# Altium project DataTranslator.PrjPcb
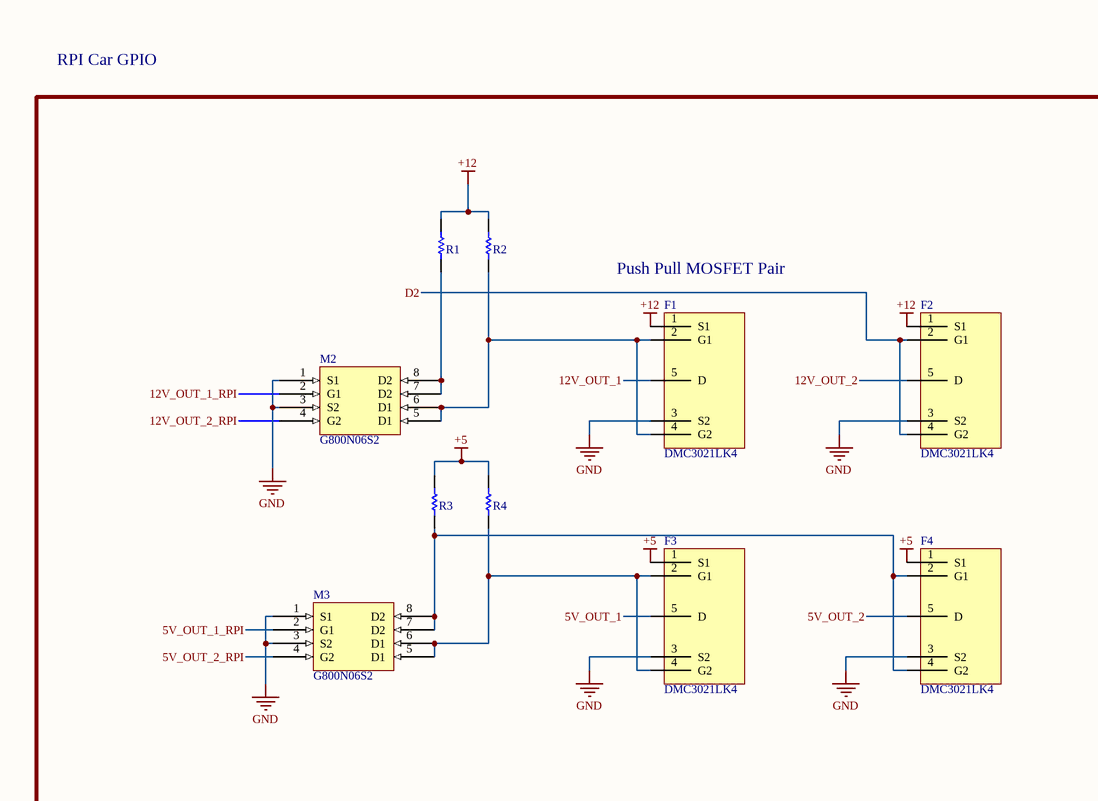
[diagram p0: DataTranslator.SchDoc, left]
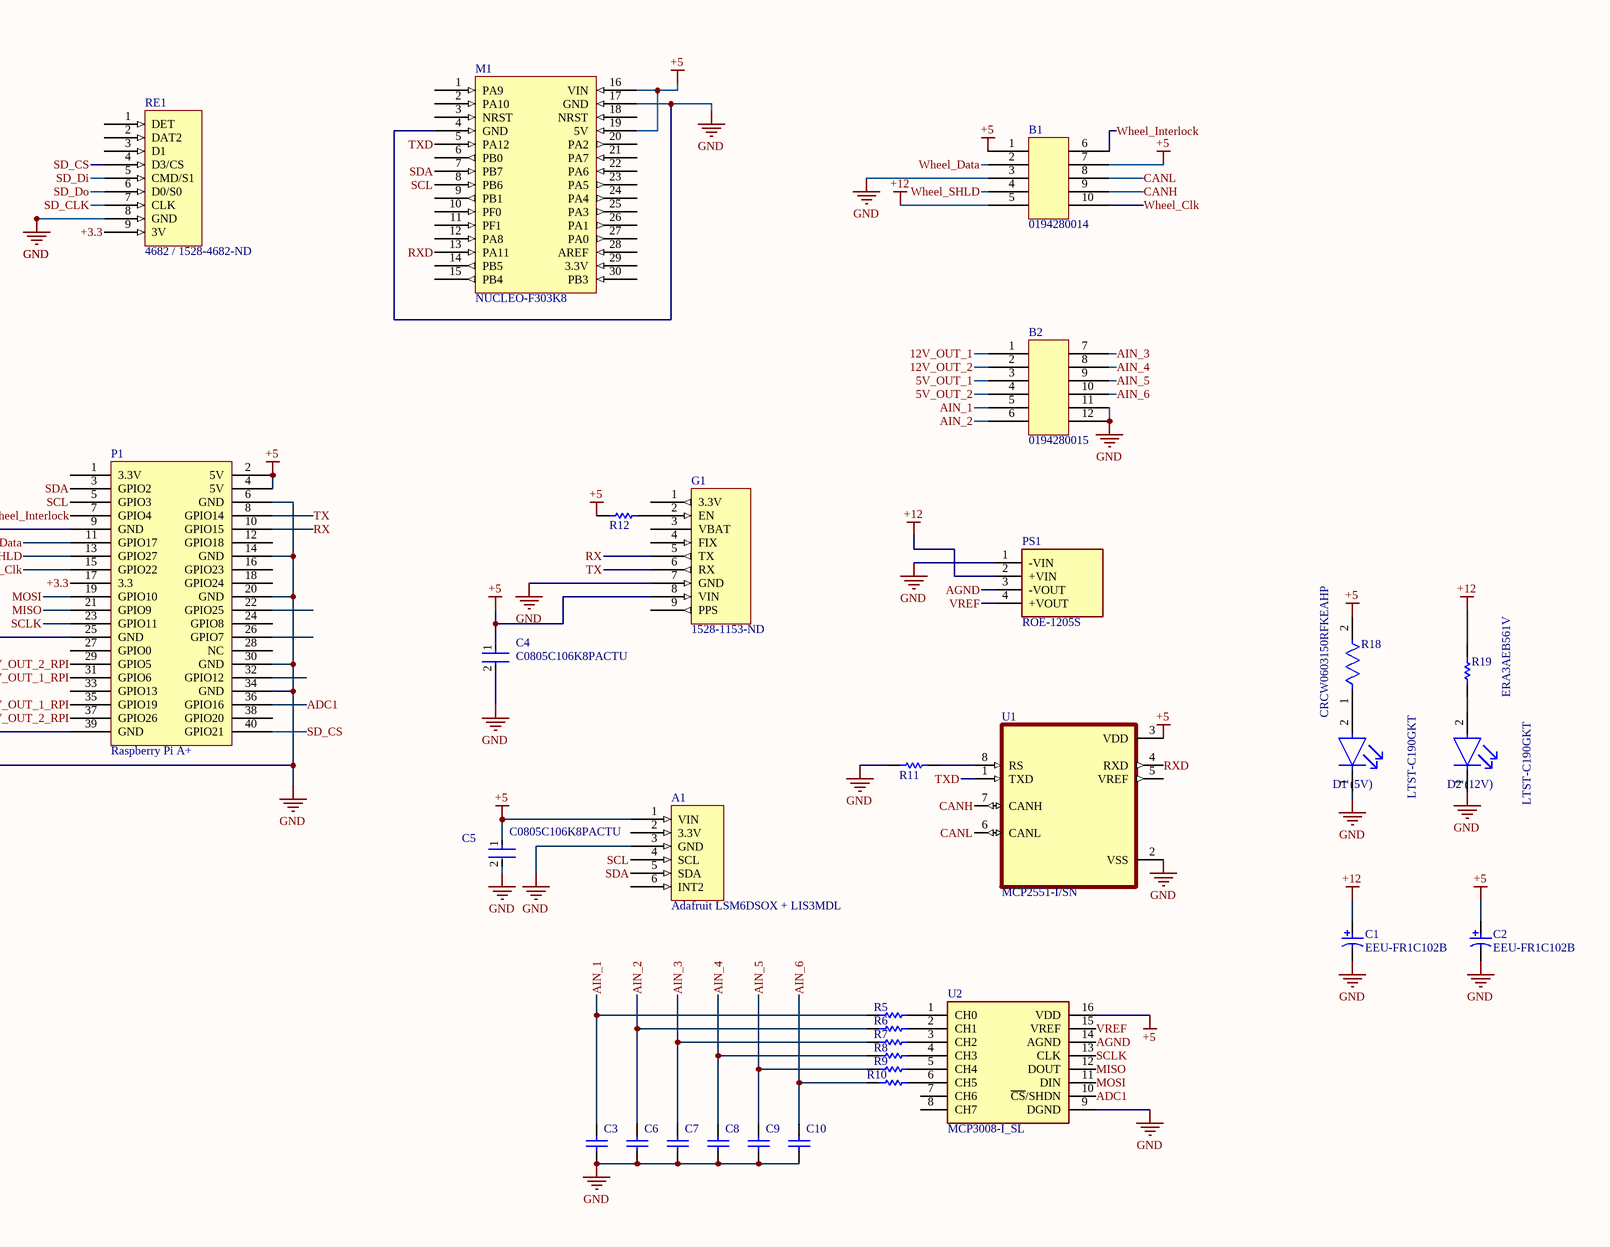
[diagram p1: DataTranslator.SchDoc, right]
1 sheet, 42 parts. Net scope: global (net labels, ports and power ports of the same name join across sheets).
Board file: DataTranslator.PcbDoc

## Sheet DataTranslator.SchDoc
size E; SheetNumber: 1; SheetTotal: 1

### Parts
A1  Adafruit LSM6DSOX + LIS3MDL  [4097 Accelerometer]
B1  0194280014  [0194280014]
B2  0194280015  [0194280015]
C1  EEU-FR1C102B  [PNSC-EEUFM1H221-2]
C2  EEU-FR1C102B  [PNSC-EEUFM1H221-2]
C3  C0805C105K4PACTU  [CAPC2013X145X50LL20T25]  (value not drawn)
C4  C0805C106K8PACTU  [FP-C0805C-DG-MFG]
C5  C0805C106K8PACTU  [FP-C0805C-DG-MFG]
C6  C0805C105K4PACTU  [CAPC2013X145X50LL20T25]  (value not drawn)
C7  C0805C105K4PACTU  [CAPC2013X145X50LL20T25]  (value not drawn)
C8  C0805C105K4PACTU  [CAPC2013X145X50LL20T25]  (value not drawn)
C9  C0805C105K4PACTU  [CAPC2013X145X50LL20T25]  (value not drawn)
C10  C0805C105K4PACTU  [CAPC2013X145X50LL20T25]  (value not drawn)
D1_(5V)  LTST-C190GKT  [FP-LTST-C190GKT-MFG]
D2_(12V)  LTST-C190GKT  [FP-LTST-C190GKT-MFG]
F1  DMC3021LK4  [DMC3021LK4]
F2  DMC3021LK4  [DMC3021LK4]
F3  DMC3021LK4  [DMC3021LK4]
F4  DMC3021LK4  [DMC3021LK4]
G1  1528-1153-ND  [GPS]
M1  NUCLEO-F303K8  [STM Footprint]
M2  G800N06S2  [G800N06S2]
M3  G800N06S2  [G800N06S2]
P1  Raspberry Pi A+  [Raspberry Pi A+]
PS1  ROE-1205S  [ROE-1205S]
R1  RC0805FR-0710KL  [RESC2013X60X35NL10T20]  (value not drawn)
R2  RC0805FR-0710KL  [RESC2013X60X35NL10T20]  (value not drawn)
R3  RC0805FR-0710KL  [RESC2013X60X35NL10T20]  (value not drawn)
R4  RC0805FR-0710KL  [RESC2013X60X35NL10T20]  (value not drawn)
R5  RC0805FR-0710KL  [RESC2013X60X35NL10T20]  (value not drawn)
R6  RC0805FR-0710KL  [RESC2013X60X35NL10T20]  (value not drawn)
R7  RC0805FR-0710KL  [RESC2013X60X35NL10T20]  (value not drawn)
R8  RC0805FR-0710KL  [RESC2013X60X35NL10T20]  (value not drawn)
R9  RC0805FR-0710KL  [RESC2013X60X35NL10T20]  (value not drawn)
R10  RC0805FR-0710KL  [RESC2013X60X35NL10T20]  (value not drawn)
R11  RC0805FR-0710KL  [RESC2013X60X35NL10T20]  (value not drawn)
R12  RC0805FR-0710KL  [RESC2013X60X35NL10T20]  (value not drawn)
R18  CRCW0603150RFKEAHP  [FP-CRCW0603-HPe3-MFG]
R19  ERA3AEB561V  [RESC1608X55X30LL20T20]
RE1  4682 / 1528-4682-ND  [SDCARD]
U1  MCP2551-I/SN  [CAN Transceiver]
U2  MCP3008-I_SL  [SOIC127P600X175-16N]

### Blocks framed on the sheet
Push Pull MOSFET Pair: F1-F4 M2 M3 R1-R4

### Nets
+5: A1.1(VIN) B1.1 B1.7 C2.1 C4.1 C5.1 F3.1(S1) F4.1(S1) G1.8(VIN) M1.16(VIN) M1.19(5V) P1.2(5V) P1.4(5V) R3.2 R4.2 R12.1 R18.2 U1.3(VDD) U2.16(VDD)
+12: B1.5 C1.1 F1.1(S1) F2.1(S1) PS1.2(+VIN) R1.2 R2.2 R19.2
GND: A1.3(GND) B1.3 B2.11 B2.12 C1.2 C2.2 C3.2 C4.2 C5.2 C6.2 C7.2 C8.2 C9.2 C10.2 D1_(5V).1(C) D2_(12V).1(C) F1.3(S2) F2.3(S2) F3.3(S2) F4.3(S2) G1.7(GND) M1.4(GND) M1.17(GND) M2.1(S1) M2.3(S2) M3.1(S1) M3.3(S2) P1.6(GND) P1.9(GND) P1.14(GND) P1.20(GND) P1.25(GND) P1.30(GND) P1.34(GND) P1.39(GND) PS1.1(-VIN) R11.1 RE1.8(GND) U1.2(VSS) U2.9(DGND)
5V_OUT_1: B2.3 F3.5(D)
5V_OUT_1_RPI: M3.2(G1) P1.35(GPIO19)
5V_OUT_2: B2.4 F4.5(D)
5V_OUT_2_RPI: M3.4(G2) P1.37(GPIO26)
12V_OUT_1: B2.1 F1.5(D)
12V_OUT_1_RPI: M2.2(G1) P1.31(GPIO6)
12V_OUT_2: B2.2 F2.5(D)
12V_OUT_2_RPI: M2.4(G2) P1.29(GPIO5)
+3.3: P1.17(3.3) RE1.9(3V)
ADC1: P1.36(GPIO16) U2.10(~{CS}/SHDN)
AGND: PS1.3(-VOUT) U2.14(AGND)
AIN_1: B2.5 C3.1 R5.1
AIN_2: B2.6 C6.1 R6.1
AIN_3: B2.7 C7.1 R7.1
AIN_4: B2.8 C8.1 R8.1
AIN_5: B2.9 C9.1 R9.1
AIN_6: B2.10 C10.1 R10.1
CANH: B1.9 U1.7(CANH)
CANL: B1.8 U1.6(CANL)
D2: F2.2(G1) F2.4(G2)
MISO: P1.21(GPIO9) U2.12(DOUT)
MOSI: P1.19(GPIO10) U2.11(DIN)
RX: G1.5(TX) P1.10(GPIO15)
RXD: M1.13(PA11) U1.4(RXD)
SCL: A1.4(SCL) M1.8(PB6) P1.5(GPIO3)
SCLK: P1.23(GPIO11) U2.13(CLK)
SD_CLK: RE1.7(CLK)
SD_CS: P1.40(GPIO21) RE1.4(D3/CS)
SD_Di: RE1.5(CMD/S1)
SD_Do: RE1.6(D0/S0)
SDA: A1.5(SDA) M1.7(PB7) P1.3(GPIO2)
TX: G1.6(RX) P1.8(GPIO14)
TXD: M1.5(PA12) U1.1(TXD)
VREF: PS1.4(+VOUT) U2.15(VREF)
Wheel_Clk: B1.10 P1.15(GPIO22)
Wheel_Data: B1.2 P1.11(GPIO17)
Wheel_Interlock: B1.6 P1.7(GPIO4)
Wheel_SHLD: B1.4 P1.13(GPIO27)
NetD1_(5V)_2: D1_(5V).2(A) R18.1
NetD2_(12V)_2: D2_(12V).2(A) R19.1
NetF1_2: F1.2(G1) F1.4(G2) M2.5(D1) M2.6(D1) R2.1
NetF3_2: F3.2(G1) F3.4(G2) M3.5(D1) M3.6(D1) R4.1
NetF4_2: F4.2(G1) F4.4(G2) M3.7(D2) M3.8(D2) R3.1
NetG1_2: G1.2(EN) R12.2
NetM2_7: M2.7(D2) M2.8(D2) R1.1
NetR5_2: R5.2 U2.1(CH0)
NetR6_2: R6.2 U2.2(CH1)
NetR7_2: R7.2 U2.3(CH2)
NetR8_2: R8.2 U2.4(CH3)
NetR9_2: R9.2 U2.5(CH4)
NetR10_2: R10.2 U2.6(CH5)
NetR11_2: R11.2 U1.8(RS)

Not connected (* = marked no-connect by the designer): A1 2(3.3V) 6(INT2); G1 1(3.3V) 3(VBAT) 4(FIX) 9(PPS); M1 1(PA9) 2(PA10) 3(NRST) 6(PB0) 9(PB1) 10(PF0) 11(PF1) 12(PA8) 14(PB5) 15(PB4) 18(NRST) 20(PA2) 21(PA7) 22(PA6) 23(PA5) 24(PA4) 25(PA3) 26(PA1) 27(PA0) 28(AREF) 29(3.3V) 30(PB3); P1 1(3.3V) 12(GPIO18) 16(GPIO23) 18(GPIO24) 22(GPIO25) 24(GPIO8) 26(GPIO7) 27(GPIO0) 28(NC) 32(GPIO12) 33(GPIO13) 38(GPIO20); RE1 1(DET) 2(DAT2) 3(D1); U1 5(VREF); U2 7(CH6) 8(CH7)

### Notes on the sheet
- RPI Car GPIO

### Library data of the parts
A1 = 4097: ADXL343 - TRIPLE-AXIS ACCELEROMETER; Manufacturer: Adafruit Industries; Supplier: Mouser; Supplier Part Number: 485-4097; Manufacturer Part Number: 4097; RoHS: No; Stock: 330; Pricing: 1=5.95, 10=5.95, 50=5.95, 100=5.95, 1000=5.95, 10000=5.95 (USD)
B1 = 0194280014: Combination Line Connector, 10 Contact(s), Male, Solder Terminal; Manufacturer: Molex; Manufacturer Series: 19428; Contact Pattern: RECTANGULAR; Number Of Connectors: 1; Number Of PCB Rows: 2; Number of Contacts: 10; Mating Contact Pitch: 0.23inch; Mounting Option 1: LOCKING; PCB Contact Row Spacing: 5.9944mm; Plating Thickness: 100uin; Reference Standard: UL; Reliability: COMMERCIAL; Supplier: Mouser; Supplier Part Number: 538-19428-0014; Manufacturer Part Number: 0194280014; RoHS: Yes; Category: Uncategorized; Stock: 2675; Pricing: 1=6.21, 10=5.7, 50=5.7, 100=4.98, 1000=4.6, 10000=4.6 (USD); Mounting Technology: Board; Contact Finish - Mating: NOT SPECIFIED; Contact Finish - Termination: TIN OVER NICKEL; Insulation Color: Black; Insulation Material: Polybutylene; Connector Type: COMBINATION LINE CONNECTOR; Contact Gender: Male; Mounting Style: STRAIGHT; Number of Rows Loaded: 2; PCB Contact Pattern: RECTANGULAR; Termination: Solder; Terminal Pitch: 5.842mm; Reach SVHC Compliant: Yes; RoHS Compliant: Yes; ComponentLink1URL: https://datasheet.ciiva.com:443/pdfs/VipMasterIC/IC/MOLE/MOLE-S-A0006767587/MOLE-S-A0006776083-1.pdf?src-supplier=IHS+Markit; ComponentLink1Description: https://datasheet.ciiva.com:443/pdfs/VipMasterIC/IC/MOLE/MOLE-S-A0006767587/MOLE-S-A0006776083-1.pdf?src-supplier=IHS+Markit; ComponentLink2URL: https://datasheet.ciiva.com/41799/194280014-sd-41799129.pdf?src-supplier=Digi-Key; ComponentLink2Description: https://datasheet.ciiva.com/41799/194280014-sd-41799129.pdf?src-supplier=Digi-Key; ComponentLink3URL: https://datasheet.ciiva.com/10081/0194280014-pcb-headers-10081631.pdf?src-supplier=Avnet; ComponentLink3Description: https://datasheet.ciiva.com/10081/0194280014-pcb-headers-10081631.pdf?src-supplier=Avnet
B2 = 0194280015: Combination Line Connector; Manufacturer: Molex; Manufacturer Part Number: 0194280014; Manufacturer Series: 19428; Contact Pattern: RECTANGULAR; Number Of Connectors: 1; Number Of PCB Rows: 2; Number of Contacts: 10; Mating Contact Pitch: 0.23inch; Mounting Option 1: LOCKING; PCB Contact Row Spacing: 5.9944mm; Plating Thickness: 100uin; Reference Standard: UL; Reliability: COMMERCIAL; Supplier: Mouser; Supplier Part Number: 538-19428-0014; RoHS: Yes; Category: Uncategorized; Stock: 2675; Pricing: 1=6.21, 10=5.7, 50=5.7, 100=4.98, 1000=4.6, 10000=4.6 (USD); Mounting Technology: Board; Contact Finish - Mating: NOT SPECIFIED; Contact Finish - Termination: TIN OVER NICKEL; Insulation Color: Black; Insulation Material: Polybutylene; Connector Type: COMBINATION LINE CONNECTOR; Contact Gender: Male; Mounting Style: STRAIGHT; Number of Rows Loaded: 2; PCB Contact Pattern: RECTANGULAR; Termination: Solder; Terminal Pitch: 5.842mm; Reach SVHC Compliant: Yes; RoHS Compliant: Yes; ComponentLink1URL: https://datasheet.ciiva.com:443/pdfs/VipMasterIC/IC/MOLE/MOLE-S-A0006767587/MOLE-S-A0006776083-1.pdf?src-supplier=IHS+Markit; ComponentLink1Description: https://datasheet.ciiva.com:443/pdfs/VipMasterIC/IC/MOLE/MOLE-S-A0006767587/MOLE-S-A0006776083-1.pdf?src-supplier=IHS+Markit; ComponentLink2URL: https://datasheet.ciiva.com/41799/194280014-sd-41799129.pdf?src-supplier=Digi-Key; ComponentLink2Description: https://datasheet.ciiva.com/41799/194280014-sd-41799129.pdf?src-supplier=Digi-Key; ComponentLink3URL: https://datasheet.ciiva.com/10081/0194280014-pcb-headers-10081631.pdf?src-supplier=Avnet; ComponentLink3Description: https://datasheet.ciiva.com/10081/0194280014-pcb-headers-10081631.pdf?src-supplier=Avnet; ComponentLink4URL: https://datasheet.ciiva.com:443/pdfs/VipMasterIC/IC/MOLE/MOLES064408/MOLES064297-1.pdf?src-supplier=IHS+Markit; ComponentLink4Description: https://datasheet.ciiva.com:443/pdfs/VipMasterIC/IC/MOLE/MOLES064408/MOLES064297-1.pdf?src-supplier=IHS+Markit; ComponentLink5URL: https://datasheet.ciiva.com/6846/194280031-sd-6846247.pdf?src-supplier=Digi-Key; ComponentLink5Description: https://datasheet.ciiva.com/6846/194280031-sd-6846247.pdf?src-supplier=Digi-Key; ComponentLink6URL: https://datasheet.ciiva.com/9467/0194280015-pcb-headers-9467422.pdf?src-supplier=Avnet; ComponentLink6Description: https://datasheet.ciiva.com/9467/0194280015-pcb-headers-9467422.pdf?src-supplier=Avnet
C1 C2 = CMP-2000-05313-1: Aluminum Electrolytic Capacitor, 1000 uF, +/- 20%, 16 V, -40 to 105 degC, 2-Pin THD, RoHS, Tape and Reel; Manufacturer: Panasonic; Capacitance: 1000µF; Ripple Current: 1790mA; Rated Voltage: 16V; Impedance: 0.028O; Type: Radial; Lifetime@Temperature: 8000Hrs@105degC; Operating Temp-Max: 105degC; Operating Temp Range: -40to+105degC; Manufacturer URL: http://www.panasonic.com/; Datasheet URL: http://www.produktinfo.conrad.com/datenblaetter/425000-449999/446746-da-01-en-ALU_KONDENSATOR_FR_R_1000_UF_16V.pdf; Case Size/Dimension: Ø10x16mm; Datasheet Version: Nov-11; Series: FR
C3 C6-C10 = CMP-1036-04746-2: Manufacturer: Kemet; Part Number: C0805C105K4PACTU
C4 C5 = CMP-2007-03243-2: CAP CER 10UF 10V X5R 0805; Manufacturer: Kemet; 3DS Part Number: 220-00001; Tolerance: 10%; Temperature Coefficient: 15%; Material: Ceramic; Device Class L2: Capacitors; Device Class L1: Passive Components; ComponentLink2URL: https://content.kemet.com/datasheets/KEM_C1006_X5R_SMD.pdf; Height: 1.4mm; Lead Free: Yes; Manufacturer Part Number: C0805C106K8PACTU; Digikey Description: CAP CER 10UF 10V X5R 0805; Octopart: https://octopart.com/c0805c106k8pactu-kemet-98697; Capacitance: 10uF; Value: 10uF; Temperature Range Low: -55°C; Temperature: -55°C to +85°C; Automotive: No; Mouser Description: CAP CER 10UF 10V X5R 0805; Ipc Land Pattern Name: CAPC200125X125; Temperature Range High: +85°C; Voltage: 10V; RoHS: TRUE; Device Class L3: Ceramic Capacitors; ComponentLink2Description: Datasheet; Voltage Rating: 10V; Package: C0805C-DG; Temperature Characteristic: X5R; Category: Cap
D1_(5V) D2_(12V) = CMP-22017-000005-2: LED GREEN CLEAR CHIP SMD; Dominant Wavelength: 569nm; Reverse Voltage: 5V; Lens Color: Colorless; Viewing Angle: 130°; Voltage: 2V; Forward Current: 30mA; Power Dissipation: 100mW; Luminous Intensity: 6mcd; Number of LEDs: 1; Forward Voltage: 2.1V; Wavelength: 565nm; Test Current: 10mA; Min Operating Temperature: -55°C; Lens Style: Clear; Mount: Surface Mount; Width: 0.8mm; Packaging: Tape and Reel; Lens Transparency: Clear; Case Code (Metric): 1608; Depth: 0.8mm; Case Code (Imperial): 0603; Case/Package: 0603; Number of Pins: 2; Max Operating Temperature: 85°C; Lead Free: Lead Free; Number of Elements: 1; Length: 1.6mm; Height: 0.8mm; Package Quantity: 1; Power Rating: 100mW; Radiation Hardening: No; Illumination Color: Green; Color: Green
F1-F4 = DMC3021LK4: Power Field-Effect Transistor, 6.7A I(D), 30V, 0.021ohm, 2-Element, N-Channel and P-Channel, Silicon, Metal-oxide Semiconductor FET; Manufacturer: Diodes; Manufacturer Part Number: DMC3021LK4-13; Package Body Material: Plastic; Polarity/Channel Type: N-CHANNEL,P-CHANNEL; Additional Feature: HIGH RELIABILITY; Drain Current-Max (Abs) (ID): 14A; Drain-source On Resistance-Max: 21mR; Number of Elements: 2; Operating Mode: ENHANCEMENT MODE; Power Dissipation-Max (Abs): 22W; Pulsed Drain Current-Max (IDM): 40A; Time @ Peak Reflow Temperature-Max (s): 40s; Transistor Application: SWITCHING; Supplier: Digi-Key; Supplier Part Number: DMC3021LK4-13DICT-ND; RoHS: Yes; Category: MOSFETs; Stock: 2345; Pricing: 1=0.63, 10=0.536, 100=0.4004, 500=0.31462, 1000=0.24312 (USD); Pins: 4; Transistor Element Material: SILICON; Package Shape: Rectangular; Terminal Finish: Tin; Max Operating Temperature: 150°C; JESD-609 Code: e3; Drain Current-Max (ID): 6.7A; DS Breakdown Voltage-Min: 30V; FET Technology: METAL-OXIDE SEMICONDUCTOR; Moisture Sensitivity Level: 1; Package Style: SMALL OUTLINEMeter; Peak Reflow Temperature (Cel): 260°C; Surface Mount: Yes; Terminal Form: Gull Wing; Terminal Position: SINGLE; Reach SVHC Compliant: Yes; RoHS Compliant: Yes; ComponentLink1URL: https://datasheet.ciiva.com:443/pdfs/VipMasterIC/IC/DIOD/DIODS21602/DIODS21602-1.pdf?src-supplier=IHS+Markit; ComponentLink1Description: https://datasheet.ciiva.com:443/pdfs/VipMasterIC/IC/DIOD/DIODS21602/DIODS21602-1.pdf?src-supplier=IHS+Markit; ComponentLink2URL: https://datasheet.ciiva.com/6386/dmc3021lk4-6386737.pdf?src-supplier=Digi-Key; ComponentLink2Description: https://datasheet.ciiva.com/6386/dmc3021lk4-6386737.pdf?src-supplier=Digi-Key; ComponentLink3URL: https://datasheet.ciiva.com/4443/dmc3021lk4-80786-4443001.pdf?src-supplier=Mouser; ComponentLink3Description: https://datasheet.ciiva.com/4443/dmc3021lk4-80786-4443001.pdf?src-supplier=Mouser; ComponentLink4URL: https://datasheet.ciiva.com/930/dmc3021lk4-930444.pdf?src-supplier=Digi-Key; ComponentLink4Description: https://datasheet.ciiva.com/930/dmc3021lk4-930444.pdf?src-supplier=Digi-Key; ComponentLink5URL: https://datasheet.ciiva.com/6386/dmc3021lk4-6386734.pdf?src-supplier=Digi-Key; ComponentLink5Description: https://datasheet.ciiva.com/6386/dmc3021lk4-6386734.pdf?src-supplier=Digi-Key; ComponentLink6URL: https://datasheet.ciiva.com/11174/dmc3021lk4-11174949.pdf?src-supplier=Avnet; ComponentLink6Description: https://datasheet.ciiva.com/11174/dmc3021lk4-11174949.pdf?src-supplier=Avnet
G1 = 1528-1153-ND: GPS BREAKOUT 66CH W/10HZ UPDATES; Manufacturer: Adafruit Industries; Manufacturer Part Number: 746; Supplier: Digi-Key; Supplier Part Number: 1528-1153-ND; RoHS: Yes; Category: RF Semiconductors and Devices; Stock: 65; Pricing: 1=29.95 (USD); ComponentLink1URL: https://media.digikey.com/pdf/Data%20Sheets/Adafruit%20PDFs/746_Web.pdf?src-supplier=Digi-Key; ComponentLink1Description: https://media.digikey.com/pdf/Data%20Sheets/Adafruit%20PDFs/746_Web.pdf?src-supplier=Digi-Key; ComponentLink2URL: http://www.alliedelec.com/m/d/a201c4d28f3644f3ee4dce0b4167d661.pdf?src-supplier=Allied+Electronics; ComponentLink2Description: http://www.alliedelec.com/m/d/a201c4d28f3644f3ee4dce0b4167d661.pdf?src-supplier=Allied+Electronics
M1 = NUCLEO-F303K8: Boards/Accessories; Manufacturer: STMicroelectronics; Evaluation Kit: Yes; Number of Bits: 32; Core Architecture: ARM; Supplier: Newark; Supplier Part Number: 68Y1244; Manufacturer Part Number: NUCLEO-F303K8; RoHS: No; Category: Embedded Processors and Controllers; Stock: 226; Pricing: 1=10.33000 (USD); Series: STM32F3; Reach SVHC Compliant: Yes; Lead Free: Lead Free; ComponentLink1URL: http://www.farnell.com/datasheets/2064195.pdf?src-supplier=Farnell; ComponentLink1Description: http://www.farnell.com/datasheets/2064195.pdf?src-supplier=Farnell; ComponentLink2URL: http://www.st.com/content/ccc/resource/technical/document/data_brief/b1/d8/13/d4/b0/b7/4b/6e/DM00214578.pdf/files/DM00214578.pdf/jcr:content/translations/en.DM00214578.pdf?src-supplier=Digi-Key; ComponentLink2Description: http://www.st.com/content/ccc/resource/technical/document/data_brief/b1/d8/13/d4/b0/b7/4b/6e/DM00214578.pdf/files/DM00214578.pdf/jcr:content/translations/en.DM00214578.pdf?src-supplier=Digi-Key; ComponentLink3URL: http://www.st.com/st-web-ui/static/active/en/resource/technical/document/user_manual/DM00116575.pdf?s_searchtype=keyword&src-supplier=Avnet; ComponentLink3Description: http://www.st.com/st-web-ui/static/active/en/resource/technical/document/user_manual/DM00116575.pdf?s_searchtype=keyword&src-supplier=Avnet; ComponentLink4URL: http://www.farnell.com/datasheets/1966773.pdf?src-supplier=Element14; ComponentLink4Description: http://www.farnell.com/datasheets/1966773.pdf?src-supplier=Element14; ComponentLink5URL: http://www.farnell.com/datasheets/2064195.pdf?src-supplier=Newark; ComponentLink5Description: http://www.farnell.com/datasheets/2064195.pdf?src-supplier=Newark
M2 M3 = G800N06S2: DUAL N-Channel Enhancement Mode Power MOSFET; Manufacturer: GoFord; Supplier: Digi-Key; Supplier Part Number: 3141-G800N06S2CT-ND; Manufacturer Part Number: G800N06S2; RoHS: No; Stock: 3988; Pricing: 1=0.49, 10=0.395, 100=0.2688, 500=0.2016, 1000=0.1512, 2000=0.1386 (USD)
P1 = Raspberry Pi A+: SINGLE BOARD COMPUTER 700MHZ 256; Supplier: Digi-Key; Supplier Part Number: 2648-RASPBERRYPIA+-ND; Manufacturer: Raspberry Pi; Manufacturer Part Number: RASPBERRY PI A+; RoHS: Yes; Category: Single Board Computers (SBCs); Pricing: 1=20 (USD); ComponentLink1URL: https://media.digikey.com/pdf/Data%20Sheets/Raspberry%20Pi%20PDFs/Raspberry_PI_1_Model_A+_Web.pdf?src-supplier=Digi-Key; ComponentLink1Description: https://media.digikey.com/pdf/Data%20Sheets/Raspberry%20Pi%20PDFs/Raspberry_PI_1_Model_A+_Web.pdf?src-supplier=Digi-Key
PS1 = ROE-1205S: Recom Through Hole 1W Isolated DC-DC Converter, I/O isolation 1kV dc, Vout 5V dc; Manufacturer_Name: RECOM Power; Geometry.Height: 10.5mm; Manufacturer_Part_Number: ROE-1205S; Mouser Part Number: 919-ROE-1205S; Mouser Price/Stock: https://www.mouser.co.uk/ProductDetail/RECOM-Power/ROE-1205S?qs=wlO1EFRhkBDfK04Zv7WG%2Fg%3D%3D; Arrow Part Number: ROE-1205S; Arrow Price/Stock: https://www.arrow.com/en/products/roe-1205s/recom-power?region=nac; Datasheet Link: https://www.recom-power.com/pdf/Econoline/ROE.pdf
R1-R12 = CMP-1659-00013-4: Chip Resistor, 10 KOhm, +/- 1%, 0.125 W, -55 to 155 degC, 0805 (2012 Metric), RoHS, Tape and Reel; Manufacturer: Yageo; Voltage Rating: 150 V; Mount: Surface Mount; ComponentLink1Description: Manufacturer URL; ComponentLink2URL: http://www.yageo.com/documents/recent/PYu-RC_Group_51_RoHS_L_04.pdf; Pins: 2; Length: 2 mm; Min Operating Temperature: -55 degC; Height: 0.5 mm; Mounting Technology: Surface Mount; RoHSCompliant: true; REACH SVHC: No SVHC; ComponentLink1URL: http://www.yageo.com/; Max Operating Temperature: 155 degC; PackageReference: 0805; DatasheetVersion: Rev. 4, 02/2016; Package Quantity: 5000; Packaging: Tape and Reel; ComponentLink2Description: Datasheet; PackageDescription: 2-Pin Surface Mounted Device, Body 2 x 1.25 mm
R18 = CMP-02407-010710-1: RES Thick Film, 150Ω, 1%, 0.33W, 100ppm/°C, 0603; Voltage Rating: 75V; Power Rating: 250mW; Resistance: 150R; Case Code (Metric): 1608; Voltage Rating (DC): 75V; Packaging: Tape and Reel; Composition: Thick Film; Width: 0.033inch; Tolerance: 1%; Military Standard: Not; Max Operating Temperature: 155°C; Contact Plating: Tin; Case/Package: 0603; Features: Automotive AEC-Q200; Depth: 0.85mm; Height: 0.45mm; Package Quantity: 1; Case Code (Imperial): 0603; Temperature Coefficient: 100ppm/°C; Max Power Dissipation: 250mW; Lead Free: Lead Free; Min Operating Temperature: -55°C; Radiation Hardening: No; Mount: Surface Mount; Weight: 7.1E-05oz; Termination: SMD/SMT; Number of Terminations: 2; Length: 1.55mm
R19 = CMP-2000-00091-1: Manufacturer: Panasonic; Part Number: ERA3AEB561V
RE1 = 4682: MICROSD SPI/SPIO BREAKOUT BOARD; Manufacturer: Adafruit Industries; Supplier: Arrow Electronics; Supplier Part Number: 4682; Manufacturer Part Number: 4682; RoHS: No; Stock: 408; Pricing: 1=3.556 (USD)
U1 = MCP2551-I/SN: CAN Transceiver, 1-Trnsvr, PDSO8; Manufacturer: Microchip; Number of Terminals/Pins: 8; Package Body Material: Plastic; Max Supply Voltage: 5.5V; Min Supply Voltage: 4.5V; Data Rate: 1Mbps; Operating Supply Voltage: 5V; Nominal Supply Current: 75mA; Interface: Serial,CAN; Number of Transceivers: 1; Slew Rate: 8.5V/µs; Time @ Peak Reflow Temperature-Max (s): 40s; Package Equivalence Code: SOP8,.25; Telecom IC Type: INTERFACE CIRCUIT; Qualification Status: Not Qualified; Package: None; MP: MCP2551-I/SN; Price: None; Availability: Unavailable; Value: *; Supplier: Newark; Supplier Part Number: 69K7604; Manufacturer Part Number: MCP2551-I/SN; RoHS: Yes; Category: Interface ICs; Stock: 47560; Pricing: 1=1.37000, 10=1.32000, 25=1.26000, 50=1.26000, 100=1.25000 (USD); Mounting Technology: Surface Mount; Case/Package: SOIC; Pins: 8; Contact Plating: Tin,Matte; Package Shape: Rectangular; Terminal Finish: Tin; Min Operating Temperature: -40°C; Max Operating Temperature: 85°C; Packaging: Rail/Tube; Package Quantity: 100; Supply Current: 75mA; Number of Transmit Buffers: 1; Number of Receive Buffers: 1; Max Supply Current: 75mA; Number of Drivers: 1; Number of Receivers: 1; Logic Function: Transceiver; Channels: 1; Nominal Supply Voltage: 5.5V; JESD-30 Code: R-PDSO-G8; Moisture Sensitivity Level: 1; Peak Reflow Temperature (Cel): 260°C; Surface Mount: Yes; Terminal Form: Gull Wing; Terminal Position: DUAL; Length: 4.9mm; Width: 3.9mm; Height: 1.25mm; Radiation Hardening: No; Reach SVHC Compliant: Yes; RoHS Compliant: Yes; Lead Free: Lead Free; Temperature Grade: INDUSTRIAL; ComponentLink1URL: https://datasheet.ciiva.com/27056/2040583-27056423.pdf?src-supplier=Jameco; ComponentLink1Description: https://datasheet.ciiva.com/27056/2040583-27056423.pdf?src-supplier=Jameco; ComponentLink2URL: https://datasheet.ciiva.com/8084/jp011797-8084592.pdf?src-supplier=Avnet; ComponentLink2Description: https://datasheet.ciiva.com/8084/jp011797-8084592.pdf?src-supplier=Avnet; ComponentLink3URL: https://datasheet.ciiva.com/14152/eb644223-644224-e-14152540.pdf?src-supplier=Distrelec; ComponentLink3Description: https://datasheet.ciiva.com/14152/eb644223-644224-e-14152540.pdf?src-supplier=Distrelec; ComponentLink4URL: https://datasheet.ciiva.com/1495/21667f-1495089.pdf?src-supplier=Element14; ComponentLink4Description: https://datasheet.ciiva.com/1495/21667f-1495089.pdf?src-supplier=Element14; ComponentLink5URL: https://datasheet.ciiva.com/1700/21667f-1700023.pdf?src-supplier=Digi-Key; ComponentLink5Description: https://datasheet.ciiva.com/1700/21667f-1700023.pdf?src-supplier=Digi-Key; Package Style: SMALL OUTLINEMeter; JESD-609 Code: e3; Power Supplies: 5V; Technology: CMOS; Height - Seated (Max): 1.75mm; Terminal Pitch: 1.27mm; ComponentLink6URL: https://datasheet.ciiva.com:443/pdfs/VipMasterIC/IC/MCHP/MCHP-S-A0002782162/MCHP-S-A0002782162-1.pdf?src-supplier=IHS+Markit; ComponentLink6Description: https://datasheet.ciiva.com:443/pdfs/VipMasterIC/IC/MCHP/MCHP-S-A0002782162/MCHP-S-A0002782162-1.pdf?src-supplier=IHS+Markit
U2 = MCP3008-I_SL: 10-bit ADC, 8-channel, SPI Microchip MCP3008-I/SL, 10 bit Serial ADC, Differential Input, 16-Pin SOIC; Geometry.Height: 1.75mm; Manufacturer_Name: Microchip; Manufacturer_Part_Number: MCP3008-I/SL; Mouser Part Number: 579-MCP3008-I/SL; Mouser Price/Stock: https://www.mouser.co.uk/ProductDetail/Microchip-Technology-Atmel/MCP3008-I-SL?qs=BYQkrObauiuZK6Atf%2FfReA%3D%3D; Arrow Part Number: MCP3008-I/SL; Arrow Price/Stock: https://www.arrow.com/en/products/mcp3008-isl/microchip-technology?region=nac; Datasheet Link: https://datasheet.datasheetarchive.com/originals/distributors/Datasheets-DGA17/1031059.pdf